# EAGLE schematic Logic Engine - Rear SK6812 (EAGLE 6.6.0)
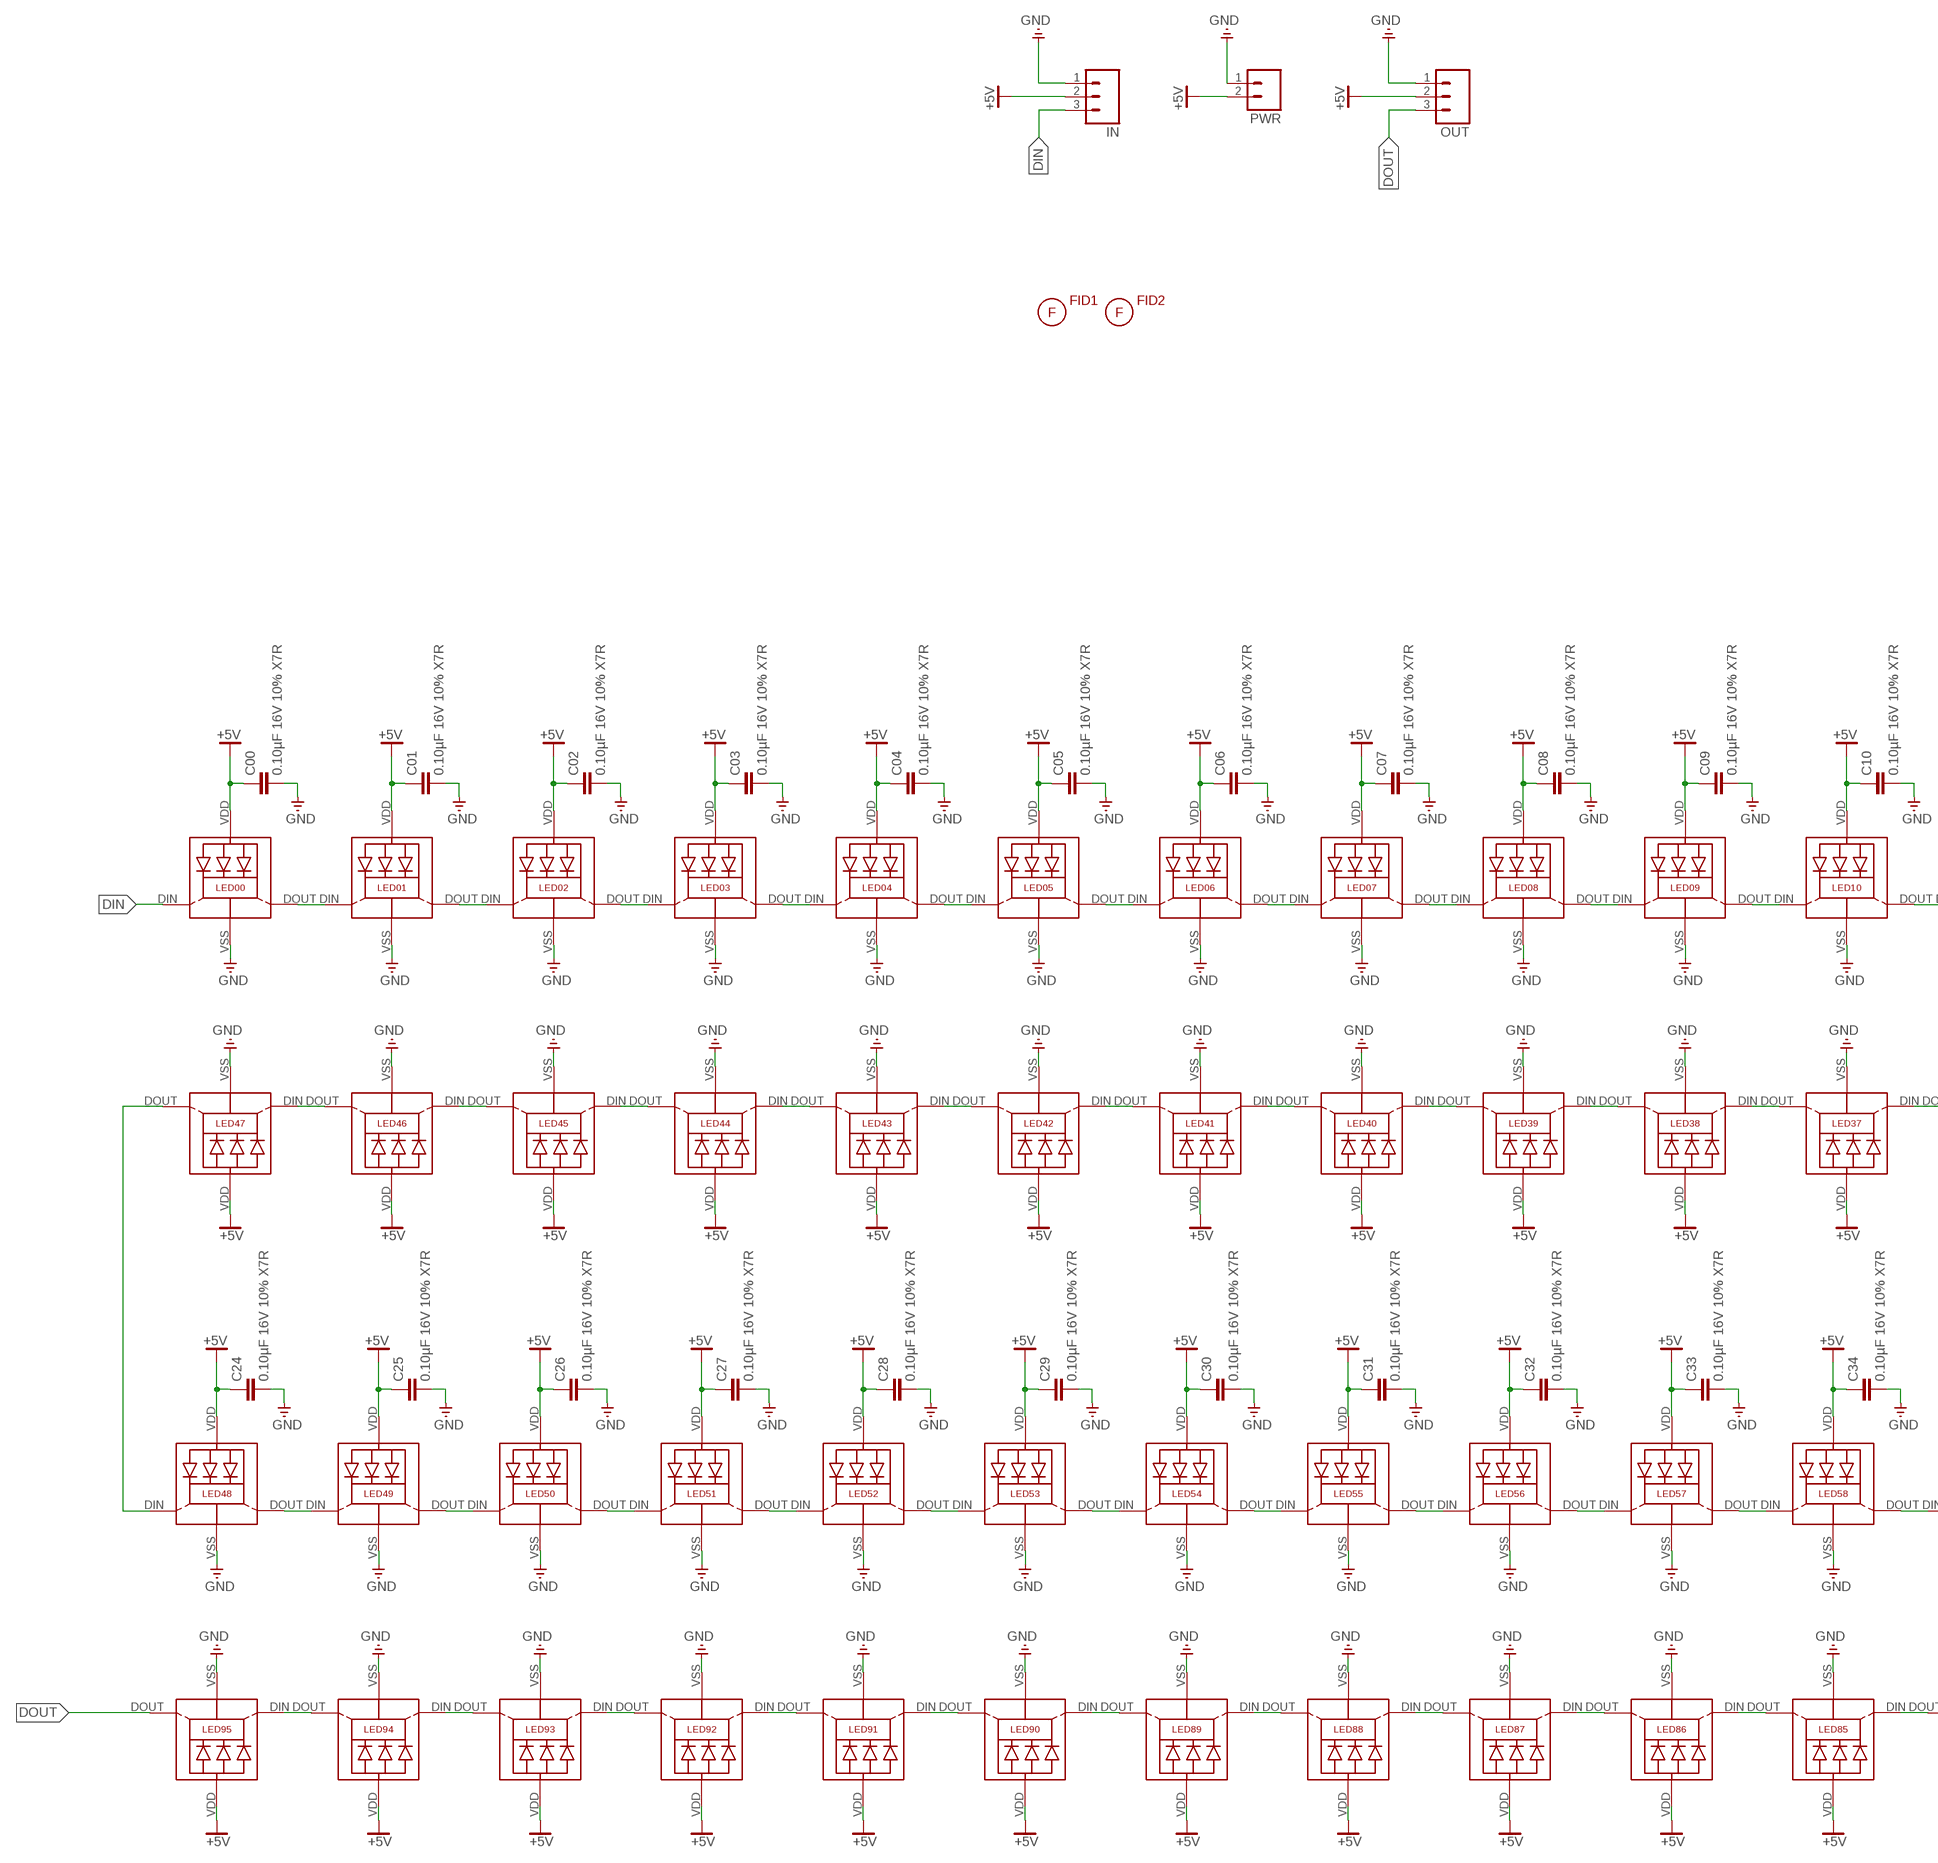
[diagram p0: schematic, sheet 1, part 1 of 2]
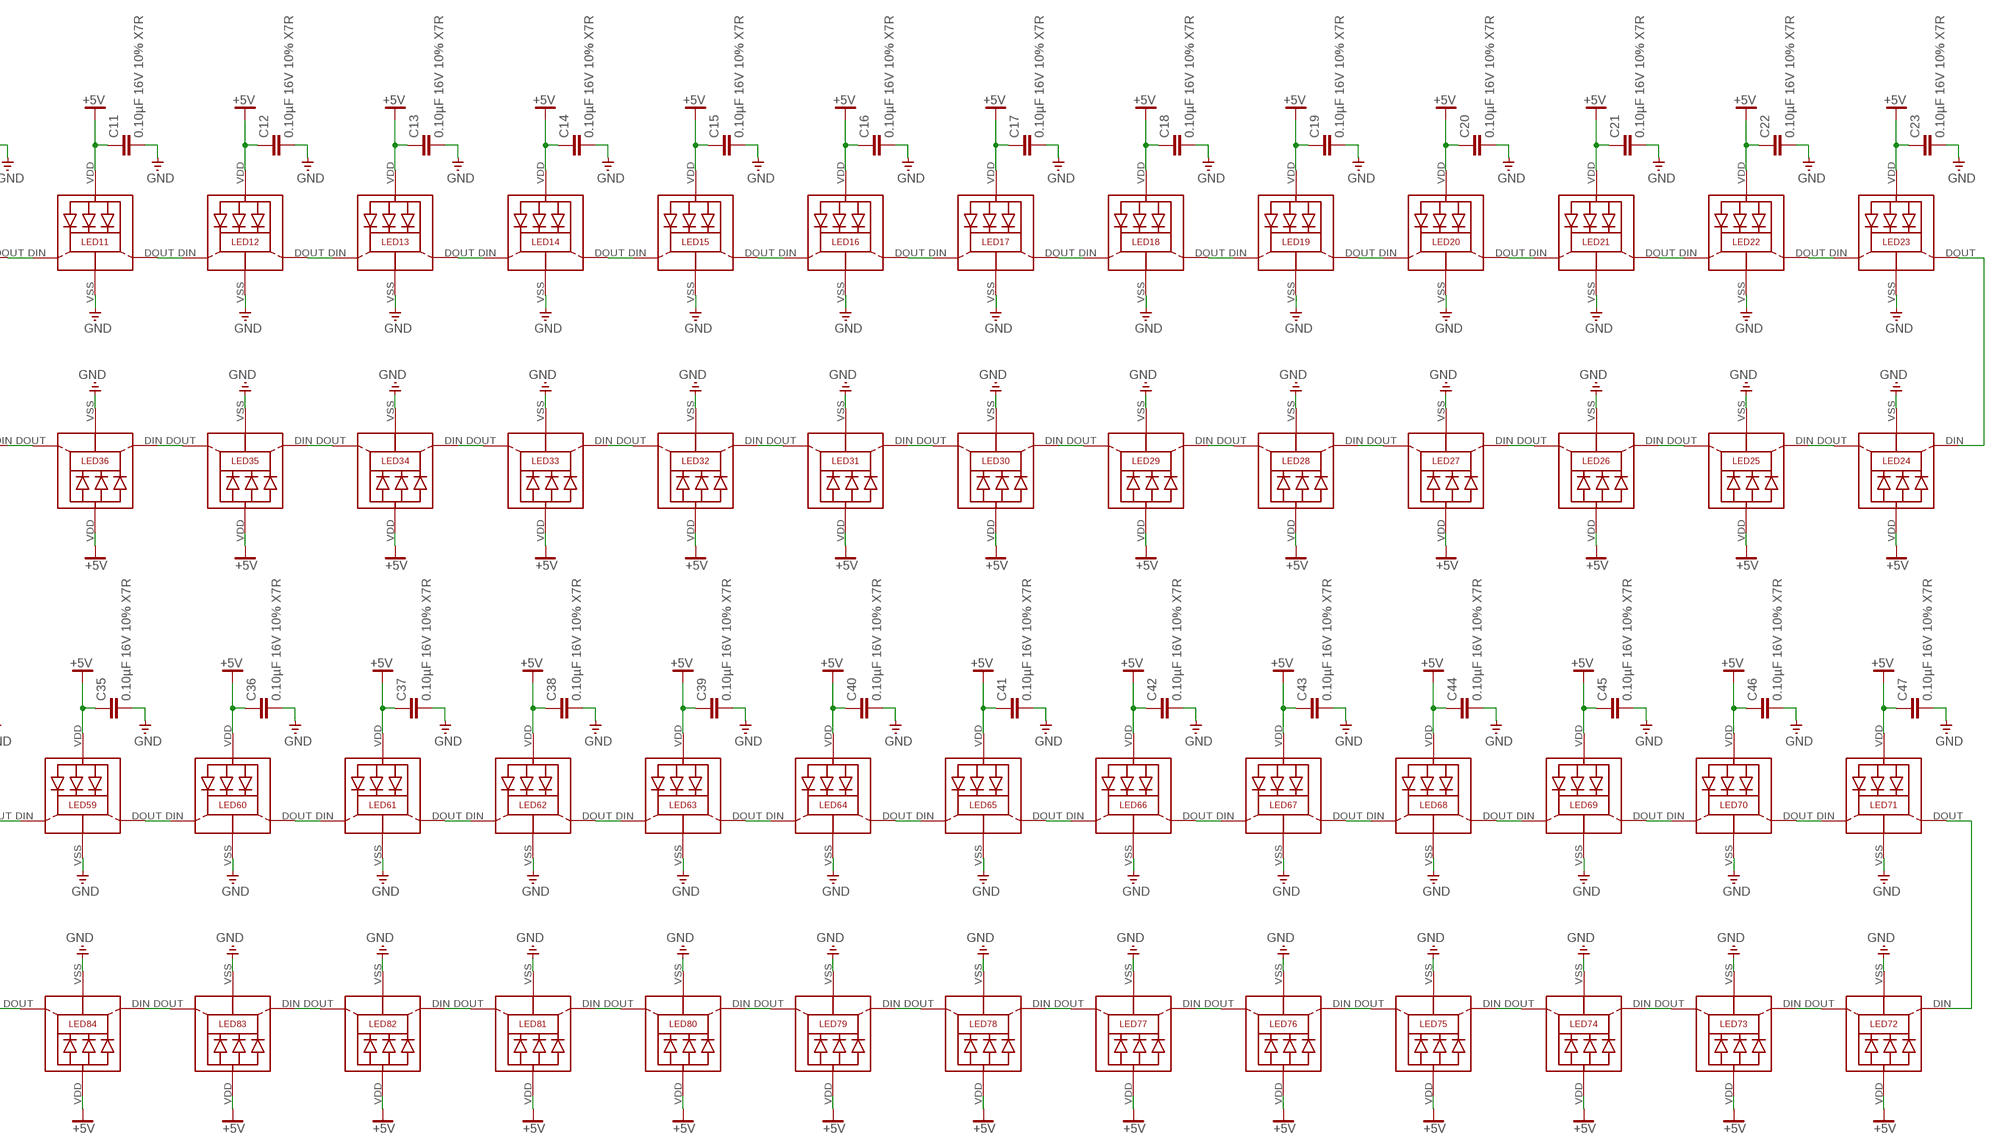
[diagram p1: schematic, sheet 1, part 2 of 2]

## Parts
C00  0.10µF 16V 10% X7R  C-EUC0603  [C0603]
C01  0.10µF 16V 10% X7R  C-EUC0603  [C0603]
C02  0.10µF 16V 10% X7R  C-EUC0603  [C0603]
C03  0.10µF 16V 10% X7R  C-EUC0603  [C0603]
C04  0.10µF 16V 10% X7R  C-EUC0603  [C0603]
C05  0.10µF 16V 10% X7R  C-EUC0603  [C0603]
C06  0.10µF 16V 10% X7R  C-EUC0603  [C0603]
C07  0.10µF 16V 10% X7R  C-EUC0603  [C0603]
C08  0.10µF 16V 10% X7R  C-EUC0603  [C0603]
C09  0.10µF 16V 10% X7R  C-EUC0603  [C0603]
C10  0.10µF 16V 10% X7R  C-EUC0603  [C0603]
C11  0.10µF 16V 10% X7R  C-EUC0603  [C0603]
C12  0.10µF 16V 10% X7R  C-EUC0603  [C0603]
C13  0.10µF 16V 10% X7R  C-EUC0603  [C0603]
C14  0.10µF 16V 10% X7R  C-EUC0603  [C0603]
C15  0.10µF 16V 10% X7R  C-EUC0603  [C0603]
C16  0.10µF 16V 10% X7R  C-EUC0603  [C0603]
C17  0.10µF 16V 10% X7R  C-EUC0603  [C0603]
C18  0.10µF 16V 10% X7R  C-EUC0603  [C0603]
C19  0.10µF 16V 10% X7R  C-EUC0603  [C0603]
C20  0.10µF 16V 10% X7R  C-EUC0603  [C0603]
C21  0.10µF 16V 10% X7R  C-EUC0603  [C0603]
C22  0.10µF 16V 10% X7R  C-EUC0603  [C0603]
C23  0.10µF 16V 10% X7R  C-EUC0603  [C0603]
C24  0.10µF 16V 10% X7R  C-EUC0603  [C0603]
C25  0.10µF 16V 10% X7R  C-EUC0603  [C0603]
C26  0.10µF 16V 10% X7R  C-EUC0603  [C0603]
C27  0.10µF 16V 10% X7R  C-EUC0603  [C0603]
C28  0.10µF 16V 10% X7R  C-EUC0603  [C0603]
C29  0.10µF 16V 10% X7R  C-EUC0603  [C0603]
C30  0.10µF 16V 10% X7R  C-EUC0603  [C0603]
C31  0.10µF 16V 10% X7R  C-EUC0603  [C0603]
C32  0.10µF 16V 10% X7R  C-EUC0603  [C0603]
C33  0.10µF 16V 10% X7R  C-EUC0603  [C0603]
C34  0.10µF 16V 10% X7R  C-EUC0603  [C0603]
C35  0.10µF 16V 10% X7R  C-EUC0603  [C0603]
C36  0.10µF 16V 10% X7R  C-EUC0603  [C0603]
C37  0.10µF 16V 10% X7R  C-EUC0603  [C0603]
C38  0.10µF 16V 10% X7R  C-EUC0603  [C0603]
C39  0.10µF 16V 10% X7R  C-EUC0603  [C0603]
C40  0.10µF 16V 10% X7R  C-EUC0603  [C0603]
C41  0.10µF 16V 10% X7R  C-EUC0603  [C0603]
C42  0.10µF 16V 10% X7R  C-EUC0603  [C0603]
C43  0.10µF 16V 10% X7R  C-EUC0603  [C0603]
C44  0.10µF 16V 10% X7R  C-EUC0603  [C0603]
C45  0.10µF 16V 10% X7R  C-EUC0603  [C0603]
C46  0.10µF 16V 10% X7R  C-EUC0603  [C0603]
C47  0.10µF 16V 10% X7R  C-EUC0603  [C0603]
FID1  FIDUCIAL  [FIDUCIAL_G15]
FID2  FIDUCIAL  [FIDUCIAL_G15]
IN  M03PTH  [1X03]
LED00  SK6812MINI  WS2812BSK6812MINI  [SK6812MINI]
LED01  SK6812MINI  WS2812BSK6812MINI  [SK6812MINI]
LED02  SK6812MINI  WS2812BSK6812MINI  [SK6812MINI]
LED03  SK6812MINI  WS2812BSK6812MINI  [SK6812MINI]
LED04  SK6812MINI  WS2812BSK6812MINI  [SK6812MINI]
LED05  SK6812MINI  WS2812BSK6812MINI  [SK6812MINI]
LED06  SK6812MINI  WS2812BSK6812MINI  [SK6812MINI]
LED07  SK6812MINI  WS2812BSK6812MINI  [SK6812MINI]
LED08  SK6812MINI  WS2812BSK6812MINI  [SK6812MINI]
LED09  SK6812MINI  WS2812BSK6812MINI  [SK6812MINI]
LED10  SK6812MINI  WS2812BSK6812MINI  [SK6812MINI]
LED11  SK6812MINI  WS2812BSK6812MINI  [SK6812MINI]
LED12  SK6812MINI  WS2812BSK6812MINI  [SK6812MINI]
LED13  SK6812MINI  WS2812BSK6812MINI  [SK6812MINI]
LED14  SK6812MINI  WS2812BSK6812MINI  [SK6812MINI]
LED15  SK6812MINI  WS2812BSK6812MINI  [SK6812MINI]
LED16  SK6812MINI  WS2812BSK6812MINI  [SK6812MINI]
LED17  SK6812MINI  WS2812BSK6812MINI  [SK6812MINI]
LED18  SK6812MINI  WS2812BSK6812MINI  [SK6812MINI]
LED19  SK6812MINI  WS2812BSK6812MINI  [SK6812MINI]
LED20  SK6812MINI  WS2812BSK6812MINI  [SK6812MINI]
LED21  SK6812MINI  WS2812BSK6812MINI  [SK6812MINI]
LED22  SK6812MINI  WS2812BSK6812MINI  [SK6812MINI]
LED23  SK6812MINI  WS2812BSK6812MINI  [SK6812MINI]
LED24  SK6812MINI  WS2812BSK6812MINI  [SK6812MINI]
LED25  SK6812MINI  WS2812BSK6812MINI  [SK6812MINI]
LED26  SK6812MINI  WS2812BSK6812MINI  [SK6812MINI]
LED27  SK6812MINI  WS2812BSK6812MINI  [SK6812MINI]
LED28  SK6812MINI  WS2812BSK6812MINI  [SK6812MINI]
LED29  SK6812MINI  WS2812BSK6812MINI  [SK6812MINI]
LED30  SK6812MINI  WS2812BSK6812MINI  [SK6812MINI]
LED31  SK6812MINI  WS2812BSK6812MINI  [SK6812MINI]
LED32  SK6812MINI  WS2812BSK6812MINI  [SK6812MINI]
LED33  SK6812MINI  WS2812BSK6812MINI  [SK6812MINI]
LED34  SK6812MINI  WS2812BSK6812MINI  [SK6812MINI]
LED35  SK6812MINI  WS2812BSK6812MINI  [SK6812MINI]
LED36  SK6812MINI  WS2812BSK6812MINI  [SK6812MINI]
LED37  SK6812MINI  WS2812BSK6812MINI  [SK6812MINI]
LED38  SK6812MINI  WS2812BSK6812MINI  [SK6812MINI]
LED39  SK6812MINI  WS2812BSK6812MINI  [SK6812MINI]
LED40  SK6812MINI  WS2812BSK6812MINI  [SK6812MINI]
LED41  SK6812MINI  WS2812BSK6812MINI  [SK6812MINI]
LED42  SK6812MINI  WS2812BSK6812MINI  [SK6812MINI]
LED43  SK6812MINI  WS2812BSK6812MINI  [SK6812MINI]
LED44  SK6812MINI  WS2812BSK6812MINI  [SK6812MINI]
LED45  SK6812MINI  WS2812BSK6812MINI  [SK6812MINI]
LED46  SK6812MINI  WS2812BSK6812MINI  [SK6812MINI]
LED47  SK6812MINI  WS2812BSK6812MINI  [SK6812MINI]
LED48  SK6812MINI  WS2812BSK6812MINI  [SK6812MINI]
LED49  SK6812MINI  WS2812BSK6812MINI  [SK6812MINI]
LED50  SK6812MINI  WS2812BSK6812MINI  [SK6812MINI]
LED51  SK6812MINI  WS2812BSK6812MINI  [SK6812MINI]
LED52  SK6812MINI  WS2812BSK6812MINI  [SK6812MINI]
LED53  SK6812MINI  WS2812BSK6812MINI  [SK6812MINI]
LED54  SK6812MINI  WS2812BSK6812MINI  [SK6812MINI]
LED55  SK6812MINI  WS2812BSK6812MINI  [SK6812MINI]
LED56  SK6812MINI  WS2812BSK6812MINI  [SK6812MINI]
LED57  SK6812MINI  WS2812BSK6812MINI  [SK6812MINI]
LED58  SK6812MINI  WS2812BSK6812MINI  [SK6812MINI]
LED59  SK6812MINI  WS2812BSK6812MINI  [SK6812MINI]
LED60  SK6812MINI  WS2812BSK6812MINI  [SK6812MINI]
LED61  SK6812MINI  WS2812BSK6812MINI  [SK6812MINI]
LED62  SK6812MINI  WS2812BSK6812MINI  [SK6812MINI]
LED63  SK6812MINI  WS2812BSK6812MINI  [SK6812MINI]
LED64  SK6812MINI  WS2812BSK6812MINI  [SK6812MINI]
LED65  SK6812MINI  WS2812BSK6812MINI  [SK6812MINI]
LED66  SK6812MINI  WS2812BSK6812MINI  [SK6812MINI]
LED67  SK6812MINI  WS2812BSK6812MINI  [SK6812MINI]
LED68  SK6812MINI  WS2812BSK6812MINI  [SK6812MINI]
LED69  SK6812MINI  WS2812BSK6812MINI  [SK6812MINI]
LED70  SK6812MINI  WS2812BSK6812MINI  [SK6812MINI]
LED71  SK6812MINI  WS2812BSK6812MINI  [SK6812MINI]
LED72  SK6812MINI  WS2812BSK6812MINI  [SK6812MINI]
LED73  SK6812MINI  WS2812BSK6812MINI  [SK6812MINI]
LED74  SK6812MINI  WS2812BSK6812MINI  [SK6812MINI]
LED75  SK6812MINI  WS2812BSK6812MINI  [SK6812MINI]
LED76  SK6812MINI  WS2812BSK6812MINI  [SK6812MINI]
LED77  SK6812MINI  WS2812BSK6812MINI  [SK6812MINI]
LED78  SK6812MINI  WS2812BSK6812MINI  [SK6812MINI]
LED79  SK6812MINI  WS2812BSK6812MINI  [SK6812MINI]
LED80  SK6812MINI  WS2812BSK6812MINI  [SK6812MINI]
LED81  SK6812MINI  WS2812BSK6812MINI  [SK6812MINI]
LED82  SK6812MINI  WS2812BSK6812MINI  [SK6812MINI]
LED83  SK6812MINI  WS2812BSK6812MINI  [SK6812MINI]
LED84  SK6812MINI  WS2812BSK6812MINI  [SK6812MINI]
LED85  SK6812MINI  WS2812BSK6812MINI  [SK6812MINI]
LED86  SK6812MINI  WS2812BSK6812MINI  [SK6812MINI]
LED87  SK6812MINI  WS2812BSK6812MINI  [SK6812MINI]
LED88  SK6812MINI  WS2812BSK6812MINI  [SK6812MINI]
LED89  SK6812MINI  WS2812BSK6812MINI  [SK6812MINI]
LED90  SK6812MINI  WS2812BSK6812MINI  [SK6812MINI]
LED91  SK6812MINI  WS2812BSK6812MINI  [SK6812MINI]
LED92  SK6812MINI  WS2812BSK6812MINI  [SK6812MINI]
LED93  SK6812MINI  WS2812BSK6812MINI  [SK6812MINI]
LED94  SK6812MINI  WS2812BSK6812MINI  [SK6812MINI]
LED95  SK6812MINI  WS2812BSK6812MINI  [SK6812MINI]
OUT  M03PTH  [1X03]
PWR  M02PTH  [1X02]

## Nets
+5V [supply]: C00.1 C01.1 C02.1 C03.1 C04.1 C05.1 C06.1 C07.1 C08.1 C09.1 C10.1 C11.1 C12.1 C13.1 C14.1 C15.1 C16.1 C17.1 C18.1 C19.1 C20.1 C21.1 C22.1 C23.1 C24.1 C25.1 C26.1 C27.1 C28.1 C29.1 C30.1 C31.1 C32.1 C33.1 C34.1 C35.1 C36.1 C37.1 C38.1 C39.1 C40.1 C41.1 C42.1 C43.1 C44.1 C45.1 C46.1 C47.1 IN.2 LED00.VDD LED01.VDD LED02.VDD LED03.VDD LED04.VDD LED05.VDD LED06.VDD LED07.VDD LED08.VDD LED09.VDD LED10.VDD LED11.VDD LED12.VDD LED13.VDD LED14.VDD LED15.VDD LED16.VDD LED17.VDD LED18.VDD LED19.VDD LED20.VDD LED21.VDD LED22.VDD LED23.VDD LED24.VDD LED25.VDD LED26.VDD LED27.VDD LED28.VDD LED29.VDD LED30.VDD LED31.VDD LED32.VDD LED33.VDD LED34.VDD LED35.VDD LED36.VDD LED37.VDD LED38.VDD LED39.VDD LED40.VDD LED41.VDD LED42.VDD LED43.VDD LED44.VDD LED45.VDD LED46.VDD LED47.VDD LED48.VDD LED49.VDD LED50.VDD LED51.VDD LED52.VDD LED53.VDD LED54.VDD LED55.VDD LED56.VDD LED57.VDD LED58.VDD LED59.VDD LED60.VDD LED61.VDD LED62.VDD LED63.VDD LED64.VDD LED65.VDD LED66.VDD LED67.VDD LED68.VDD LED69.VDD LED70.VDD LED71.VDD LED72.VDD LED73.VDD LED74.VDD LED75.VDD LED76.VDD LED77.VDD LED78.VDD LED79.VDD LED80.VDD LED81.VDD LED82.VDD LED83.VDD LED84.VDD LED85.VDD LED86.VDD LED87.VDD LED88.VDD LED89.VDD LED90.VDD LED91.VDD LED92.VDD LED93.VDD LED94.VDD LED95.VDD OUT.2 PWR.2
DIN: IN.3 LED00.DIN(DI)
DOUT: LED95.DOUT(DO) OUT.3
GND [supply]: C00.2 C01.2 C02.2 C03.2 C04.2 C05.2 C06.2 C07.2 C08.2 C09.2 C10.2 C11.2 C12.2 C13.2 C14.2 C15.2 C16.2 C17.2 C18.2 C19.2 C20.2 C21.2 C22.2 C23.2 C24.2 C25.2 C26.2 C27.2 C28.2 C29.2 C30.2 C31.2 C32.2 C33.2 C34.2 C35.2 C36.2 C37.2 C38.2 C39.2 C40.2 C41.2 C42.2 C43.2 C44.2 C45.2 C46.2 C47.2 IN.1 LED00.VSS(GND) LED01.VSS(GND) LED02.VSS(GND) LED03.VSS(GND) LED04.VSS(GND) LED05.VSS(GND) LED06.VSS(GND) LED07.VSS(GND) LED08.VSS(GND) LED09.VSS(GND) LED10.VSS(GND) LED11.VSS(GND) LED12.VSS(GND) LED13.VSS(GND) LED14.VSS(GND) LED15.VSS(GND) LED16.VSS(GND) LED17.VSS(GND) LED18.VSS(GND) LED19.VSS(GND) LED20.VSS(GND) LED21.VSS(GND) LED22.VSS(GND) LED23.VSS(GND) LED24.VSS(GND) LED25.VSS(GND) LED26.VSS(GND) LED27.VSS(GND) LED28.VSS(GND) LED29.VSS(GND) LED30.VSS(GND) LED31.VSS(GND) LED32.VSS(GND) LED33.VSS(GND) LED34.VSS(GND) LED35.VSS(GND) LED36.VSS(GND) LED37.VSS(GND) LED38.VSS(GND) LED39.VSS(GND) LED40.VSS(GND) LED41.VSS(GND) LED42.VSS(GND) LED43.VSS(GND) LED44.VSS(GND) LED45.VSS(GND) LED46.VSS(GND) LED47.VSS(GND) LED48.VSS(GND) LED49.VSS(GND) LED50.VSS(GND) LED51.VSS(GND) LED52.VSS(GND) LED53.VSS(GND) LED54.VSS(GND) LED55.VSS(GND) LED56.VSS(GND) LED57.VSS(GND) LED58.VSS(GND) LED59.VSS(GND) LED60.VSS(GND) LED61.VSS(GND) LED62.VSS(GND) LED63.VSS(GND) LED64.VSS(GND) LED65.VSS(GND) LED66.VSS(GND) LED67.VSS(GND) LED68.VSS(GND) LED69.VSS(GND) LED70.VSS(GND) LED71.VSS(GND) LED72.VSS(GND) LED73.VSS(GND) LED74.VSS(GND) LED75.VSS(GND) LED76.VSS(GND) LED77.VSS(GND) LED78.VSS(GND) LED79.VSS(GND) LED80.VSS(GND) LED81.VSS(GND) LED82.VSS(GND) LED83.VSS(GND) LED84.VSS(GND) LED85.VSS(GND) LED86.VSS(GND) LED87.VSS(GND) LED88.VSS(GND) LED89.VSS(GND) LED90.VSS(GND) LED91.VSS(GND) LED92.VSS(GND) LED93.VSS(GND) LED94.VSS(GND) LED95.VSS(GND) OUT.1 PWR.1
N$1: LED00.DOUT(DO) LED01.DIN(DI)
N$2: LED02.DOUT(DO) LED03.DIN(DI)
N$3: LED01.DOUT(DO) LED02.DIN(DI)
N$4: LED04.DOUT(DO) LED05.DIN(DI)
N$5: LED06.DOUT(DO) LED07.DIN(DI)
N$6: LED05.DOUT(DO) LED06.DIN(DI)
N$7: LED03.DOUT(DO) LED04.DIN(DI)
N$8: LED08.DOUT(DO) LED09.DIN(DI)
N$9: LED10.DOUT(DO) LED11.DIN(DI)
N$10: LED09.DOUT(DO) LED10.DIN(DI)
N$11: LED12.DOUT(DO) LED13.DIN(DI)
N$12: LED14.DOUT(DO) LED15.DIN(DI)
N$13: LED13.DOUT(DO) LED14.DIN(DI)
N$14: LED11.DOUT(DO) LED12.DIN(DI)
N$15: LED07.DOUT(DO) LED08.DIN(DI)
N$16: LED16.DOUT(DO) LED17.DIN(DI)
N$17: LED18.DOUT(DO) LED19.DIN(DI)
N$18: LED17.DOUT(DO) LED18.DIN(DI)
N$19: LED20.DOUT(DO) LED21.DIN(DI)
N$20: LED22.DOUT(DO) LED23.DIN(DI)
N$21: LED21.DOUT(DO) LED22.DIN(DI)
N$22: LED19.DOUT(DO) LED20.DIN(DI)
N$23: LED15.DOUT(DO) LED16.DIN(DI)
N$24: LED23.DOUT(DO) LED24.DIN(DI)
N$25: LED24.DOUT(DO) LED25.DIN(DI)
N$26: LED25.DOUT(DO) LED26.DIN(DI)
N$27: LED26.DOUT(DO) LED27.DIN(DI)
N$28: LED27.DOUT(DO) LED28.DIN(DI)
N$29: LED28.DOUT(DO) LED29.DIN(DI)
N$30: LED29.DOUT(DO) LED30.DIN(DI)
N$31: LED30.DOUT(DO) LED31.DIN(DI)
N$32: LED31.DOUT(DO) LED32.DIN(DI)
N$33: LED32.DOUT(DO) LED33.DIN(DI)
N$34: LED33.DOUT(DO) LED34.DIN(DI)
N$35: LED34.DOUT(DO) LED35.DIN(DI)
N$36: LED35.DOUT(DO) LED36.DIN(DI)
N$37: LED36.DOUT(DO) LED37.DIN(DI)
N$38: LED37.DOUT(DO) LED38.DIN(DI)
N$39: LED38.DOUT(DO) LED39.DIN(DI)
N$40: LED39.DOUT(DO) LED40.DIN(DI)
N$41: LED40.DOUT(DO) LED41.DIN(DI)
N$42: LED41.DOUT(DO) LED42.DIN(DI)
N$43: LED42.DOUT(DO) LED43.DIN(DI)
N$44: LED43.DOUT(DO) LED44.DIN(DI)
N$45: LED44.DOUT(DO) LED45.DIN(DI)
N$46: LED45.DOUT(DO) LED46.DIN(DI)
N$47: LED46.DOUT(DO) LED47.DIN(DI)
N$48: LED48.DOUT(DO) LED49.DIN(DI)
N$49: LED50.DOUT(DO) LED51.DIN(DI)
N$50: LED49.DOUT(DO) LED50.DIN(DI)
N$51: LED52.DOUT(DO) LED53.DIN(DI)
N$52: LED54.DOUT(DO) LED55.DIN(DI)
N$53: LED53.DOUT(DO) LED54.DIN(DI)
N$54: LED51.DOUT(DO) LED52.DIN(DI)
N$55: LED56.DOUT(DO) LED57.DIN(DI)
N$56: LED58.DOUT(DO) LED59.DIN(DI)
N$57: LED57.DOUT(DO) LED58.DIN(DI)
N$58: LED60.DOUT(DO) LED61.DIN(DI)
N$59: LED62.DOUT(DO) LED63.DIN(DI)
N$60: LED61.DOUT(DO) LED62.DIN(DI)
N$61: LED59.DOUT(DO) LED60.DIN(DI)
N$62: LED55.DOUT(DO) LED56.DIN(DI)
N$63: LED64.DOUT(DO) LED65.DIN(DI)
N$64: LED66.DOUT(DO) LED67.DIN(DI)
N$65: LED65.DOUT(DO) LED66.DIN(DI)
N$66: LED68.DOUT(DO) LED69.DIN(DI)
N$67: LED70.DOUT(DO) LED71.DIN(DI)
N$68: LED69.DOUT(DO) LED70.DIN(DI)
N$69: LED67.DOUT(DO) LED68.DIN(DI)
N$70: LED63.DOUT(DO) LED64.DIN(DI)
N$71: LED71.DOUT(DO) LED72.DIN(DI)
N$72: LED72.DOUT(DO) LED73.DIN(DI)
N$73: LED73.DOUT(DO) LED74.DIN(DI)
N$74: LED74.DOUT(DO) LED75.DIN(DI)
N$75: LED75.DOUT(DO) LED76.DIN(DI)
N$76: LED76.DOUT(DO) LED77.DIN(DI)
N$77: LED77.DOUT(DO) LED78.DIN(DI)
N$78: LED78.DOUT(DO) LED79.DIN(DI)
N$79: LED79.DOUT(DO) LED80.DIN(DI)
N$80: LED80.DOUT(DO) LED81.DIN(DI)
N$81: LED81.DOUT(DO) LED82.DIN(DI)
N$82: LED82.DOUT(DO) LED83.DIN(DI)
N$83: LED83.DOUT(DO) LED84.DIN(DI)
N$84: LED84.DOUT(DO) LED85.DIN(DI)
N$85: LED85.DOUT(DO) LED86.DIN(DI)
N$86: LED86.DOUT(DO) LED87.DIN(DI)
N$87: LED87.DOUT(DO) LED88.DIN(DI)
N$88: LED88.DOUT(DO) LED89.DIN(DI)
N$89: LED89.DOUT(DO) LED90.DIN(DI)
N$90: LED90.DOUT(DO) LED91.DIN(DI)
N$91: LED91.DOUT(DO) LED92.DIN(DI)
N$92: LED92.DOUT(DO) LED93.DIN(DI)
N$93: LED93.DOUT(DO) LED94.DIN(DI)
N$94: LED94.DOUT(DO) LED95.DIN(DI)
N$95: LED47.DOUT(DO) LED48.DIN(DI)

## Library data of the parts
C00 C01-C09 C10-C47 = rcl:C-EU: CAPACITOR, European symbol
FID1 FID2 = SmallBatchLibPre1:FIDUCIAL
IN OUT = SparkFun-Connectors:M03: Header 3 Standard 3-pin 0.1" header. Use with straight break away headers (SKU : PRT-00116), right angle break away headers (PRT-00553), swiss pins (PRT-00743), machine pins (PRT-00117), and female headers (PRT-00115). Molex polarized connector foot print use with SKU : PRT-08232 with associated crimp pins and housings.
LED00 LED01-LED09 LED10-LED95 = rseries:WS2812B: WS2812B is the 4-pin variant of the WS2812 http://www.mikrocontroller.net/attachment/180459/WS2812B_preliminary.pdf based on WS2812 from https://github.com/adafruit/Adafruit-Eagle-Library
PWR = SparkFun-Connectors:M02: Standard 2-pin 0.1" header. Use with - straight break away headers ( PRT-00116) - right angle break away headers (PRT-00553) - swiss pins (PRT-00743) - machine pins (PRT-00117) - female headers (PRT-00115) Molex polarized connector foot print use with: PRT-08233 with associated crimp pins and housings. 2.54_SCREWTERM for use with PRT-10571. 3.5mm Screw Terminal footprints for PRT-08084 5mm Screw Terminal footprints for use with PRT-08432

## Net classes
0 default: width 0.254 mm, drill 0.33 mm, clearance 0.152 mm